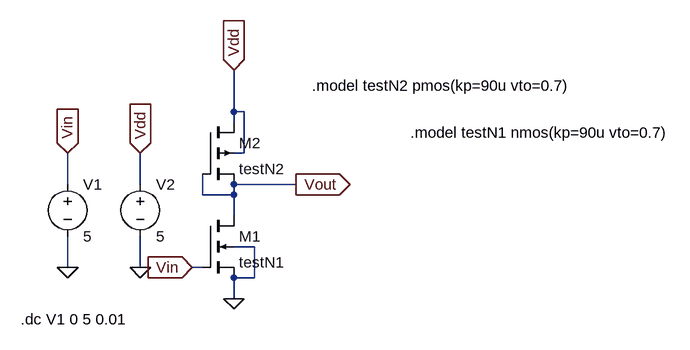
[diagram p0: schematic CS_PMOS_Diode.asc]
CS_PMOS_Diode.asc, the LTspice schematic file:
Version 4
SHEET 1 924 680
WIRE 208 32 208 -32
WIRE 224 32 208 32
WIRE 208 48 208 32
WIRE 224 96 224 32
WIRE 224 96 208 96
WIRE -48 144 -48 96
WIRE 64 144 64 96
WIRE 304 144 208 144
WIRE 160 160 160 128
WIRE 208 160 208 144
WIRE 208 160 160 160
WIRE 208 192 208 160
WIRE 240 240 208 240
WIRE -48 272 -48 224
WIRE 64 272 64 224
WIRE 160 272 144 272
WIRE 240 288 240 240
WIRE 240 288 208 288
WIRE 208 320 208 288
FLAG 208 320 0
FLAG 64 272 0
FLAG -48 272 0
FLAG -48 96 Vin
IOPIN -48 96 In
FLAG 64 96 Vdd
IOPIN 64 96 In
FLAG 144 272 Vin
IOPIN 144 272 In
FLAG 304 144 Vout
IOPIN 304 144 Out
FLAG 208 -32 Vdd
IOPIN 208 -32 In
SYMBOL nmos4 160 192 R0
SYMATTR InstName M1
SYMATTR Value testN1
SYMATTR Value2 l=45u w=9u
SYMBOL pmos4 160 48 R0
SYMATTR InstName M2
SYMATTR Value testN2
SYMATTR Value2 l=45u w=1u
SYMBOL voltage -48 128 R0
WINDOW 123 0 0 Left 0
WINDOW 39 0 0 Left 0
SYMATTR InstName V1
SYMATTR Value 5
SYMBOL voltage 64 128 R0
WINDOW 123 0 0 Left 0
WINDOW 39 0 0 Left 0
SYMATTR InstName V2
SYMATTR Value 5
TEXT -120 352 Left 2 !.dc V1 0 5 0.01
TEXT 480 64 Left 2 !.model testN1 nmos(kp=90u vto=0.7)
TEXT 328 -8 Left 2 !.model testN2 pmos(kp=90u vto=0.7)

The netlist it stands for:
* CS_PMOS_Diode.asc
M1 Vout Vin 0 0 testN1 l=45u w=9u
M2 Vdd Vout Vout Vdd testN2 l=45u w=1u
V1 Vin 0 5
V2 Vdd 0 5
.model NMOS NMOS
.model PMOS PMOS
.lib standard.mos
.dc V1 0 5 0.01
.model testN1 nmos(kp=90u vto=0.7)
.model testN2 pmos(kp=90u vto=0.7)
.backanno
.end

* Results of the author's LTspice run, read from the files saved beside the schematic
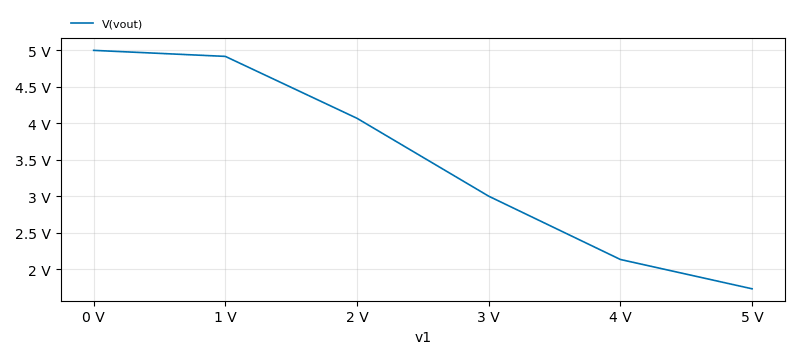
[diagram p1: DC transfer characteristic of CS_PMOS_Diode.asc, plotted from the saved traces]
* DC transfer characteristic, 1 run:
*   V(vout): 5 V at v1=0 V, 1.729 V at v1=5 V, min 1.729 V, max 5 V